# Altium schematic sheet Acoustics_4.SchDoc
size A; SheetNumber: 1; SheetTotal: 4
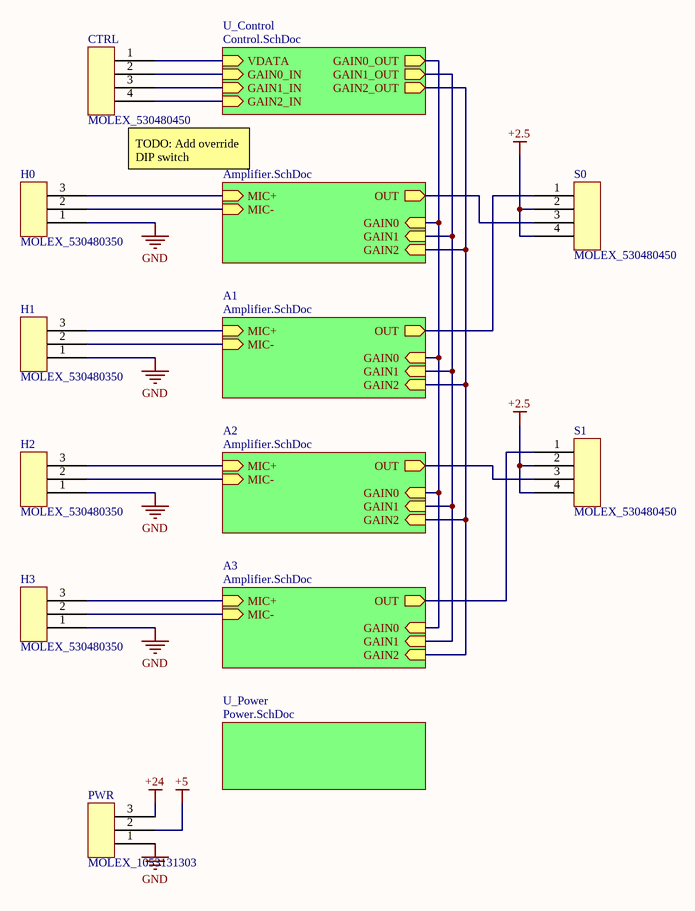
[diagram p0: Acoustics_4.SchDoc]

## Parts
CTRL  MOLEX_530480450  [MOLEX_530480450]
H0  MOLEX_530480350  [MOLEX_530480350]
H1  MOLEX_530480350  [MOLEX_530480350]
H2  MOLEX_530480350  [MOLEX_530480350]
H3  MOLEX_530480350  [MOLEX_530480350]
PWR  MOLEX_1053131303  [MOLEX_1053131303]
S0  MOLEX_530480450  [MOLEX_530480450]
S1  MOLEX_530480450  [MOLEX_530480450]

## Sub-sheets
A0 = Amplifier.SchDoc: MIC- (in), MIC+ (in), GAIN2 (in), GAIN1 (in), GAIN0 (in), OUT (out)
A1 = Amplifier.SchDoc: MIC- (in), MIC+ (in), GAIN2 (in), GAIN1 (in), GAIN0 (in), OUT (out)
A2 = Amplifier.SchDoc: MIC- (in), MIC+ (in), GAIN2 (in), GAIN1 (in), GAIN0 (in), OUT (out)
A3 = Amplifier.SchDoc: MIC- (in), MIC+ (in), GAIN2 (in), GAIN1 (in), GAIN0 (in), OUT (out)
U_Control = Control.SchDoc: VDATA (in), GAIN0_OUT (out), GAIN1_OUT (out), GAIN2_OUT (out), GAIN0_IN (in), GAIN1_IN (in), GAIN2_IN (in)
U_Power = Power.SchDoc: no entries

## Nets
+2.5: S0.2 S0.4 S1.2 S1.4
+5: PWR.2
+24: PWR.3
GND: H0.1 H1.1 H2.1 H3.1 PWR.1
NetCTRL_1: CTRL.1 ; sheet U_Control/VDATA
NetCTRL_2: CTRL.2 ; sheet U_Control/GAIN0_IN
NetCTRL_3: CTRL.3 ; sheet U_Control/GAIN1_IN
NetCTRL_4: CTRL.4 ; sheet U_Control/GAIN2_IN
NetH0_2: H0.2 ; sheet A0/MIC-
NetH0_3: H0.3 ; sheet A0/MIC+
NetH1_2: H1.2 ; sheet A1/MIC-
NetH1_3: H1.3 ; sheet A1/MIC+
NetH2_2: H2.2 ; sheet A2/MIC-
NetH2_3: H2.3 ; sheet A2/MIC+
NetH3_2: H3.2 ; sheet A3/MIC-
NetH3_3: H3.3 ; sheet A3/MIC+
NetS0_1: S0.1 ; sheet A1/OUT
NetS0_3: S0.3 ; sheet A0/OUT
NetS1_1: S1.1 ; sheet A3/OUT
NetS1_3: S1.3 ; sheet A2/OUT
(unnamed): sheet A0/GAIN2, sheet A1/GAIN2, sheet A2/GAIN2, sheet A3/GAIN2, sheet U_Control/GAIN2_OUT
(unnamed): sheet A0/GAIN1, sheet A1/GAIN1, sheet A2/GAIN1, sheet A3/GAIN1, sheet U_Control/GAIN1_OUT
(unnamed): sheet A0/GAIN0, sheet A1/GAIN0, sheet A2/GAIN0, sheet A3/GAIN0, sheet U_Control/GAIN0_OUT

## Notes on the sheet
- (near CTRL) TODO: Add override DIP switch